# EAGLE schematic dotclock (EAGLE 7.2.0)
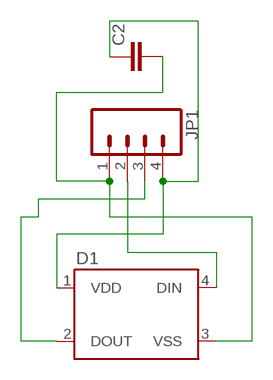
[diagram p0: schematic, sheet 1]

## Parts
C2  CAP0805  [0805]
D1  WS2812B  [WS2812B]
JP1  M04NO_SILK_ALL_ROUND  [1X04_NO_SILK_ALL_ROUND]

## Nets
N$1: C2.2 D1.3(VSS) JP1.1
N$2: C2.1 D1.1(VDD) JP1.4
N$3: D1.4(DIN) JP1.2
N$4: D1.2(DOUT) JP1.3

## Library data of the parts
C2 = SparkFun-Capacitors:CAP: Capacitor Standard 0603 ceramic capacitor, and 0.1" leaded capacitor.
D1 = SparkFun-LED:WS2812B: WS2812B - Intelligent control LED integrated light source Technical Specifications: Power Supply Voltage (VDD): 3.5 to 5.3 V Input Voltage (VI): -0.5 to VDD+0.5 V Operating Junction Temperature (Topt): -25°C to +80°C Storage Temperature Range (Tstg): -55°C to +150°C; PROD_ID: DIO-12503
JP1 = SparkFun-Connectors:M04: Header 4 Standard 4-pin 0.1" header. Use with straight break away headers (SKU : PRT-00116), right angle break away headers (PRT-00553), swiss pins (PRT-00743), machine pins (PRT-00117), and female headers (PRT-00115). Molex polarized connector foot print use with SKU : PRT-08231 with associated crimp pins and housings. 1MM SMD Version SKU: PRT-10208